# Altium schematic sheet LDR_RGB.SchDoc
size A
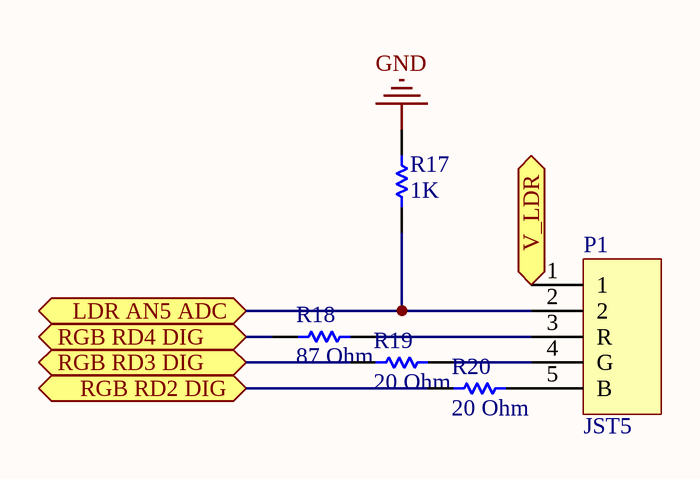
[diagram p0: LDR_RGB.SchDoc]

## Parts
P1  JST5  [LDR_RGB]
R17  1K  [Resistor0603]
R18  87 Ohm  [Resistor0603]
R19  20 Ohm  [Resistor0603]
R20  20 Ohm  [Resistor0603]

## Ports
LDR AN5 ADC, RGB RD2 DIG, RGB RD3 DIG, RGB RD4 DIG, V_LDR

## Nets
GND: R17.2
LDR AN5 ADC: P1.2 R17.1 ; port LDR AN5 ADC
RGB RD2 DIG: R20.1 ; port RGB RD2 DIG
RGB RD3 DIG: R19.1 ; port RGB RD3 DIG
RGB RD4 DIG: R18.1 ; port RGB RD4 DIG
V_LDR: P1.1 ; port V_LDR
NetP1_3: P1.3(R) R18.2
NetP1_4: P1.4(G) R19.2
NetP1_5: P1.5(B) R20.2

## Library data of the parts
P1 = MHDR1X5: Header, 5-Pin; LatestRevisionDate: 17-Jul-2002; LatestRevisionNote: Re-released for DXP Platform.; Publisher: Altium Limited
R17-R20 = Res1: Resistor; Published: 8-Jun-2000; LatestRevisionDate: 17-Jul-2002; LatestRevisionNote: Re-released for DXP Platform.; PackageReference: AXIAL-0.3; Publisher: Altium Limited; PackageDescription: Axial Device, Thru-Hole; 2 Leads; 0.3 in Pin Spacing
  R17: Value: 1K
  R18: Value: 87 Ohm
  R19 R20: Value: 20 Ohm